# Altium project PCB_Project1.PrjPCB
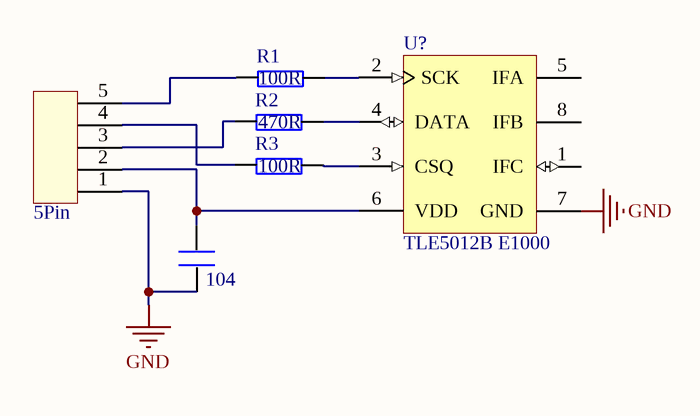
[diagram p0: TLE5012BIIF&SSC.SchDoc]
1 sheet, 6 parts. Net scope: global (net labels, ports and power ports of the same name join across sheets).
Board file: PCB1.PcbDoc

## Sheet TLE5012BIIF&SSC.SchDoc
size A4

### Parts
*  5Pin  [5Pin]
C  104  [0402]
R1  100R  [0402]
R2  470R  [0402]
R3  100R  [0402]
U?  TLE5012B E1000  [INF-PG-DSO-8-16_N]

### Nets
GND: *.1 C.1 U?.7(GND)
Net*_2: *.2 C.2 U?.6(VDD)
Net*_3: *.3 R2.1
Net*_4: *.4 R3.1
Net*_5: *.5 R1.1
NetR1_2: R1.2 U?.2(SCK)
NetR2_2: R2.2 U?.4(DATA)
NetR3_2: R3.2 U?.3(CSQ)

Not connected (* = marked no-connect by the designer): U? 1(IFC) 5(IFA) 8(IFB)

### Library data of the parts
C = C
R1-R3 = R
U? = TLE5012B E1000: GMR-Based Angle Sensor, PG-DSO-8-16, Reel, Green; Manufacturer: Infineon; Green: TRUE; Interface: SPI, IIF; DatasheetVersion: Rev. 1.1; PackageVersion: Mar-07; PackageReference: PG-DSO-8-16; PackageDescription: 8-Pin Plastic (Green) Dual Small Outline Package, 4.9 x 3.9 mm Body, 1.27 mm Pitch; Supplier 1: Mouser; Supplier Part Number 1: 726-TLE5012BE1000; Halogen-free: available; Packing: Reel; Mounting Technology: Surface Mount; PartNumber: TLE5012B E1000; ComponentLink1Description: Manufacturer URL; ComponentLink1URL: http://www.infineon.com/; ComponentLink2Description: Datasheet; ComponentLink2URL: http://www.infineon.com/dgdl/TLE5012B_FDS_Rev1+1.pdf?folderId=db3a30431ce5fb52011d3dd6e8012582&fileId=db3a304334fac4c601350f31c43c433f; ComponentLink3Description: Package Specification; ComponentLink3URL: http://www.infineon.com/dgdl/TLE7259-2GE_DS_rev12.pdf?folderId=db3a3043163797a6011666d32a0c0de1&fileId=db3a3043163797a6011666d4dbb80de2&location=en.Products.Automotive_ICs.Automotive_Transceivers.LIN_Transceivers.DATASHEET.TLE7259-2GE_DS_rev12.pdf